# EAGLE design gd32f407v_bb (EAGLE 7.3.0)
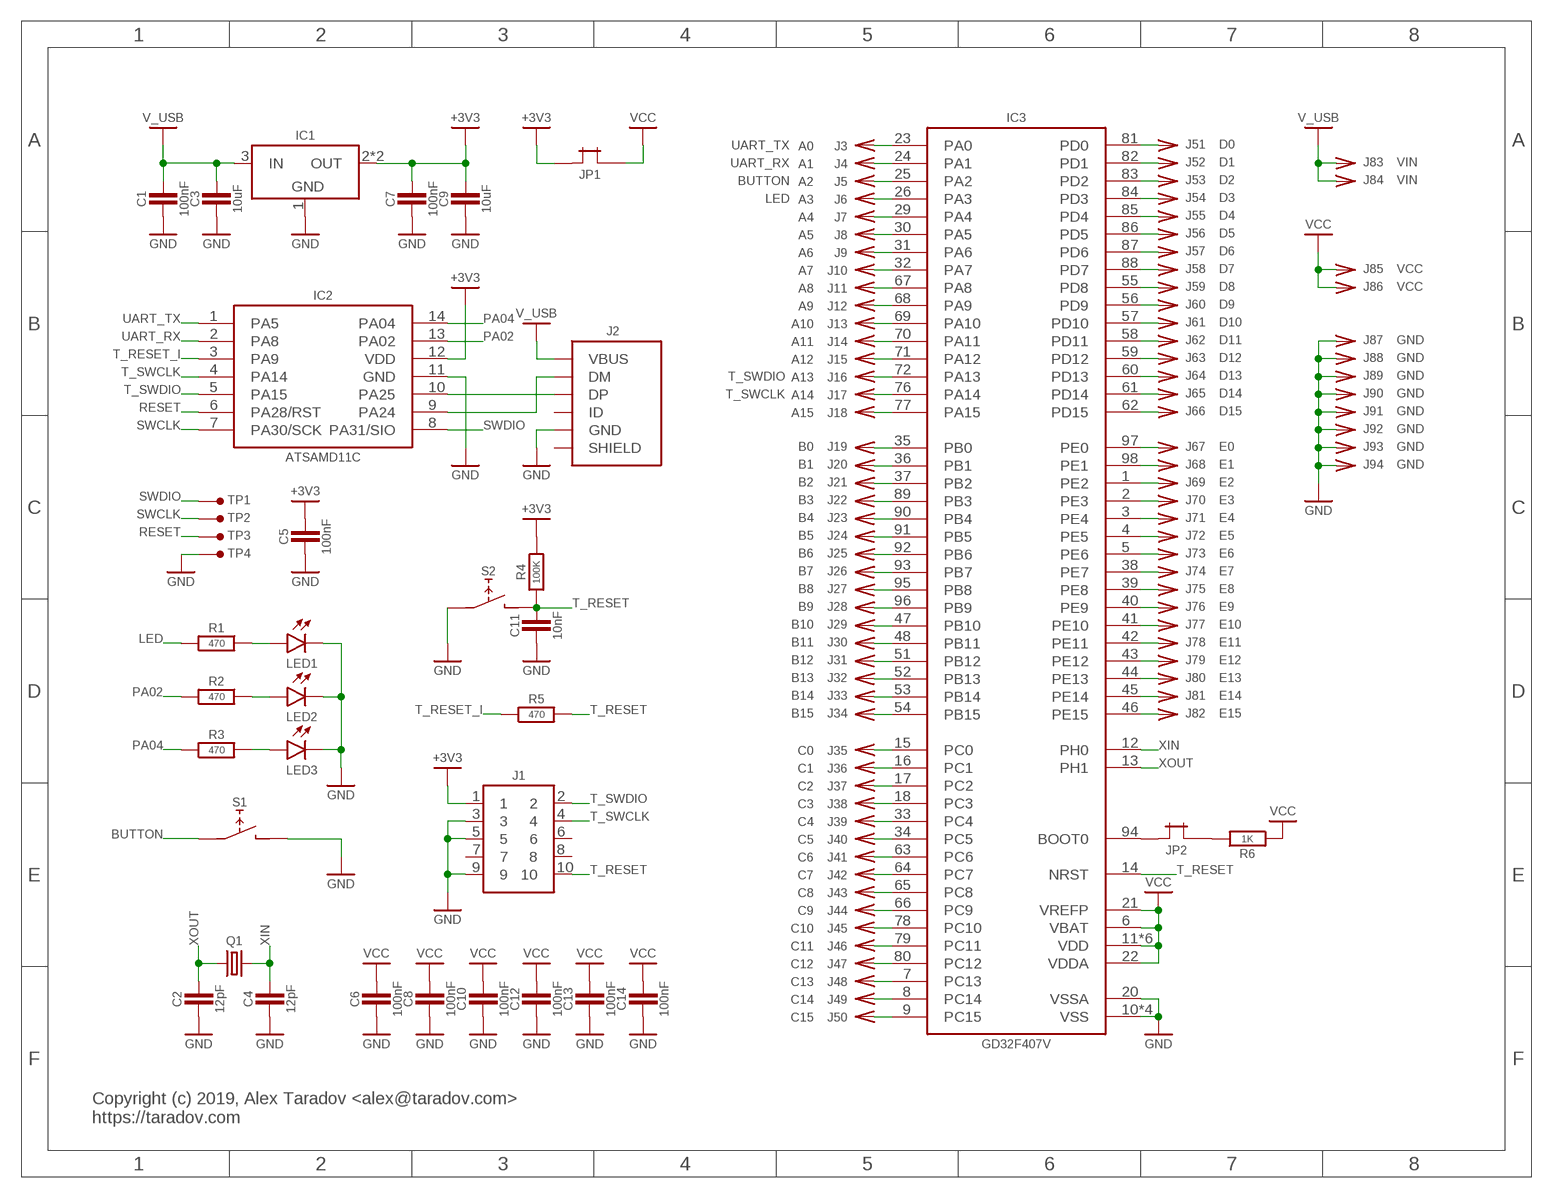
[diagram p0: schematic, sheet 1]

## Parts
C1  100nF  C-0603  [SMD0603]
C2  12pF  C-0603  [SMD0603]
C3  10uF  C-0805  [SMD0805]
C4  12pF  C-0603  [SMD0603]
C5  100nF  C-0603  [SMD0603]
C6  100nF  C-0603  [SMD0603]
C7  100nF  C-0603  [SMD0603]
C8  100nF  C-0603  [SMD0603]
C9  10uF  C-0805  [SMD0805]
C10  100nF  C-0603  [SMD0603]
C11  10nF  C-0603  [SMD0603]
C12  100nF  C-0603  [SMD0603]
C13  100nF  C-0603  [SMD0603]
C14  100nF  C-0603  [SMD0603]
IC1  LM1117-SOT223  [SOT223]
IC2  ATSAMD11C  [SO-14]
IC3  GD32F407V  [TQFP-100-0.5MM]
J1  HEADER-5X2-TH-1.27  [HEADER-5X2-1.27MM]
J2  USB-B-MICRO-SMT  [USB-B-MICRO-SMT-SHELL-TH]
J3  A0  CONN-SINGLE-TH  [PIN-TH]
J4  A1  CONN-SINGLE-TH  [PIN-TH]
J5  A2  CONN-SINGLE-TH  [PIN-TH]
J6  A3  CONN-SINGLE-TH  [PIN-TH]
J7  A4  CONN-SINGLE-TH  [PIN-TH]
J8  A5  CONN-SINGLE-TH  [PIN-TH]
J9  A6  CONN-SINGLE-TH  [PIN-TH]
J10  A7  CONN-SINGLE-TH  [PIN-TH]
J11  A8  CONN-SINGLE-TH  [PIN-TH]
J12  A9  CONN-SINGLE-TH  [PIN-TH]
J13  A10  CONN-SINGLE-TH  [PIN-TH]
J14  A11  CONN-SINGLE-TH  [PIN-TH]
J15  A12  CONN-SINGLE-TH  [PIN-TH]
J16  A13  CONN-SINGLE-TH  [PIN-TH]
J17  A14  CONN-SINGLE-TH  [PIN-TH]
J18  A15  CONN-SINGLE-TH  [PIN-TH]
J19  B0  CONN-SINGLE-TH  [PIN-TH]
J20  B1  CONN-SINGLE-TH  [PIN-TH]
J21  B2  CONN-SINGLE-TH  [PIN-TH]
J22  B3  CONN-SINGLE-TH  [PIN-TH]
J23  B4  CONN-SINGLE-TH  [PIN-TH]
J24  B5  CONN-SINGLE-TH  [PIN-TH]
J25  B6  CONN-SINGLE-TH  [PIN-TH]
J26  B7  CONN-SINGLE-TH  [PIN-TH]
J27  B8  CONN-SINGLE-TH  [PIN-TH]
J28  B9  CONN-SINGLE-TH  [PIN-TH]
J29  B10  CONN-SINGLE-TH  [PIN-TH]
J30  B11  CONN-SINGLE-TH  [PIN-TH]
J31  B12  CONN-SINGLE-TH  [PIN-TH]
J32  B13  CONN-SINGLE-TH  [PIN-TH]
J33  B14  CONN-SINGLE-TH  [PIN-TH]
J34  B15  CONN-SINGLE-TH  [PIN-TH]
J35  C0  CONN-SINGLE-TH  [PIN-TH]
J36  C1  CONN-SINGLE-TH  [PIN-TH]
J37  C2  CONN-SINGLE-TH  [PIN-TH]
J38  C3  CONN-SINGLE-TH  [PIN-TH]
J39  C4  CONN-SINGLE-TH  [PIN-TH]
J40  C5  CONN-SINGLE-TH  [PIN-TH]
J41  C6  CONN-SINGLE-TH  [PIN-TH]
J42  C7  CONN-SINGLE-TH  [PIN-TH]
J43  C8  CONN-SINGLE-TH  [PIN-TH]
J44  C9  CONN-SINGLE-TH  [PIN-TH]
J45  C10  CONN-SINGLE-TH  [PIN-TH]
J46  C11  CONN-SINGLE-TH  [PIN-TH]
J47  C12  CONN-SINGLE-TH  [PIN-TH]
J48  C13  CONN-SINGLE-TH  [PIN-TH]
J49  C14  CONN-SINGLE-TH  [PIN-TH]
J50  C15  CONN-SINGLE-TH  [PIN-TH]
J51  D0  CONN-SINGLE-TH  [PIN-TH]
J52  D1  CONN-SINGLE-TH  [PIN-TH]
J53  D2  CONN-SINGLE-TH  [PIN-TH]
J54  D3  CONN-SINGLE-TH  [PIN-TH]
J55  D4  CONN-SINGLE-TH  [PIN-TH]
J56  D5  CONN-SINGLE-TH  [PIN-TH]
J57  D6  CONN-SINGLE-TH  [PIN-TH]
J58  D7  CONN-SINGLE-TH  [PIN-TH]
J59  D8  CONN-SINGLE-TH  [PIN-TH]
J60  D9  CONN-SINGLE-TH  [PIN-TH]
J61  D10  CONN-SINGLE-TH  [PIN-TH]
J62  D11  CONN-SINGLE-TH  [PIN-TH]
J63  D12  CONN-SINGLE-TH  [PIN-TH]
J64  D13  CONN-SINGLE-TH  [PIN-TH]
J65  D14  CONN-SINGLE-TH  [PIN-TH]
J66  D15  CONN-SINGLE-TH  [PIN-TH]
J67  E0  CONN-SINGLE-TH  [PIN-TH]
J68  E1  CONN-SINGLE-TH  [PIN-TH]
J69  E2  CONN-SINGLE-TH  [PIN-TH]
J70  E3  CONN-SINGLE-TH  [PIN-TH]
J71  E4  CONN-SINGLE-TH  [PIN-TH]
J72  E5  CONN-SINGLE-TH  [PIN-TH]
J73  E6  CONN-SINGLE-TH  [PIN-TH]
J74  E7  CONN-SINGLE-TH  [PIN-TH]
J75  E8  CONN-SINGLE-TH  [PIN-TH]
J76  E9  CONN-SINGLE-TH  [PIN-TH]
J77  E10  CONN-SINGLE-TH  [PIN-TH]
J78  E11  CONN-SINGLE-TH  [PIN-TH]
J79  E12  CONN-SINGLE-TH  [PIN-TH]
J80  E13  CONN-SINGLE-TH  [PIN-TH]
J81  E14  CONN-SINGLE-TH  [PIN-TH]
J82  E15  CONN-SINGLE-TH  [PIN-TH]
J83  VIN  CONN-SINGLE-TH  [PIN-TH]
J84  VIN  CONN-SINGLE-TH  [PIN-TH]
J85  VCC  CONN-SINGLE-TH  [PIN-TH]
J86  VCC  CONN-SINGLE-TH  [PIN-TH]
J87  GND  CONN-SINGLE-TH  [PIN-TH]
J88  GND  CONN-SINGLE-TH  [PIN-TH]
J89  GND  CONN-SINGLE-TH  [PIN-TH]
J90  GND  CONN-SINGLE-TH  [PIN-TH]
J91  GND  CONN-SINGLE-TH  [PIN-TH]
J92  GND  CONN-SINGLE-TH  [PIN-TH]
J93  GND  CONN-SINGLE-TH  [PIN-TH]
J94  GND  CONN-SINGLE-TH  [PIN-TH]
JP1  JUMPER-TH-TH  [JUMPER-TH]
JP2  JUMPER-TH-TH  [JUMPER-TH]
LED1  LED_SMDLED_0603  [SMD0603]
LED2  LED_SMDLED_0603  [SMD0603]
LED3  LED_SMDLED_0603  [SMD0603]
Q1  XTAL-CTS406  [CTS406]
R1  470  R-0603  [SMD0603]
R2  470  R-0603  [SMD0603]
R3  470  R-0603  [SMD0603]
R4  100K  R-0603  [SMD0603]
R5  470  R-0603  [SMD0603]
R6  1K  R-0603  [SMD0603]
S1  TACT_SWITCH_6MM-SMD-HALF  [TACT-SMD-6MM-HALF]
S2  TACT_SWITCH_6MM-SMD-HALF  [TACT-SMD-6MM-HALF]
TP1  SIO  TEST-POINT-1.27MM  [TP-1.27MM]
TP2  TEST-POINT-1.27MM  [TP-1.27MM]
TP3  TEST-POINT-1.27MM  [TP-1.27MM]
TP4  TEST-POINT-1.27MM  [TP-1.27MM]

## Nets
+3V3: C5.2 C7.2 C9.2 IC1.2(OUT) IC1.4(OUT) IC2.12(VDD) J1.1 JP1.1 R4.2
BUTTON: IC3.25(PA2) J5.1 S1.1
GND: C1.1 C2.1 C3.1 C4.1 C5.1 C6.1 C7.1 C8.1 C9.1 C10.1 C11.1 C12.1 C13.1 C14.1 IC1.1(GND) IC2.11(GND) IC3.10(VSS) IC3.20(VSSA) IC3.27(VSS) IC3.74(VSS) IC3.99(VSS) J1.3 J1.5 J1.9 J2.5(GND) J87.1 J88.1 J89.1 J90.1 J91.1 J92.1 J93.1 J94.1 LED1.2(C) LED2.2(C) LED3.2(C) S1.2 S2.1 TP4.1
LED: IC3.26(PA3) J6.1 R1.1
N$1: IC2.9(PA24) J2.2(DM)
N$2: IC2.10(PA25) J2.3(DP)
N$4: LED2.1(A) R2.2
N$6: LED3.1(A) R3.2
N$10: IC3.29(PA4) J7.1
N$12: IC3.30(PA5) J8.1
N$13: IC3.31(PA6) J9.1
N$14: IC3.32(PA7) J10.1
N$15: IC3.67(PA8) J11.1
N$16: IC3.68(PA9) J12.1
N$17: IC3.69(PA10) J13.1
N$18: IC3.70(PA11) J14.1
N$19: IC3.71(PA12) J15.1
N$22: IC3.77(PA15) J18.1
N$23: IC3.81(PD0) J51.1
N$24: IC3.82(PD1) J52.1
N$25: IC3.83(PD2) J53.1
N$26: IC3.84(PD3) J54.1
N$27: IC3.85(PD4) J55.1
N$28: IC3.86(PD5) J56.1
N$29: IC3.87(PD6) J57.1
N$30: IC3.88(PD7) J58.1
N$31: IC3.55(PD8) J59.1
N$32: IC3.56(PD9) J60.1
N$33: IC3.57(PD10) J61.1
N$34: IC3.58(PD11) J62.1
N$35: IC3.59(PD12) J63.1
N$36: IC3.60(PD13) J64.1
N$37: IC3.61(PD14) J65.1
N$38: IC3.62(PD15) J66.1
N$39: IC3.35(PB0) J19.1
N$40: IC3.36(PB1) J20.1
N$41: IC3.37(PB2) J21.1
N$42: IC3.89(PB3) J22.1
N$43: IC3.90(PB4) J23.1
N$44: IC3.91(PB5) J24.1
N$45: IC3.92(PB6) J25.1
N$46: IC3.93(PB7) J26.1
N$47: IC3.95(PB8) J27.1
N$48: IC3.96(PB9) J28.1
N$49: IC3.47(PB10) J29.1
N$50: IC3.48(PB11) J30.1
N$52: IC3.51(PB12) J31.1
N$54: LED1.1(A) R1.2
N$55: IC3.52(PB13) J32.1
N$56: IC3.53(PB14) J33.1
N$57: IC3.54(PB15) J34.1
N$58: IC3.97(PE0) J67.1
N$59: IC3.98(PE1) J68.1
N$60: IC3.1(PE2) J69.1
N$61: IC3.2(PE3) J70.1
N$62: IC3.3(PE4) J71.1
N$63: IC3.4(PE5) J72.1
N$64: IC3.5(PE6) J73.1
N$65: IC3.38(PE7) J74.1
N$66: IC3.39(PE8) J75.1
N$67: IC3.40(PE9) J76.1
N$68: IC3.41(PE10) J77.1
N$69: IC3.42(PE11) J78.1
N$70: IC3.43(PE12) J79.1
N$71: IC3.44(PE13) J80.1
N$72: IC3.45(PE14) J81.1
N$73: IC3.46(PE15) J82.1
N$74: IC3.15(PC0) J35.1
N$75: IC3.16(PC1) J36.1
N$76: IC3.17(PC2) J37.1
N$77: IC3.18(PC3) J38.1
N$78: IC3.33(PC4) J39.1
N$79: IC3.34(PC5) J40.1
N$80: IC3.63(PC6) J41.1
N$81: IC3.64(PC7) J42.1
N$82: IC3.65(PC8) J43.1
N$83: IC3.66(PC9) J44.1
N$84: IC3.78(PC10) J45.1
N$85: IC3.79(PC11) J46.1
N$86: IC3.80(PC12) J47.1
N$87: IC3.7(PC13) J48.1
N$88: IC3.8(PC14) J49.1
N$89: IC3.9(PC15) J50.1
N$90: IC3.94(BOOT0) JP2.1
N$91: JP2.2 R6.2
PA02: IC2.13(PA02) R2.1
PA04: IC2.14(PA04) R3.1
RESET: IC2.6(PA28/RST) TP3.1
SWCLK: IC2.7(PA30/SCK) TP2.1
SWDIO: IC2.8(PA31/SIO) TP1.1
T_RESET: C11.2 IC3.14(NRST) J1.10 R4.1 R5.2 S2.2
T_RESET_I: IC2.3(PA9) R5.1
T_SWCLK: IC2.4(PA14) IC3.76(PA14) J1.4 J17.1
T_SWDIO: IC2.5(PA15) IC3.72(PA13) J1.2 J16.1
UART_RX: IC2.2(PA8) IC3.24(PA1) J4.1
UART_TX: IC2.1(PA5) IC3.23(PA0) J3.1
V_USB: C1.2 C3.2 IC1.3(IN) J2.1(VBUS) J83.1 J84.1
VCC: C6.2 C8.2 C10.2 C12.2 C13.2 C14.2 IC3.6(VBAT) IC3.11(VDD) IC3.19(VDD) IC3.21(VREFP) IC3.22(VDDA) IC3.28(VDD) IC3.50(VDD) IC3.75(VDD) IC3.100(VDD) J85.1 J86.1 JP1.2 R6.1
XIN: C4.2 IC3.12(PH0) Q1.3
XOUT: C2.2 IC3.13(PH1) Q1.1
Unconnected: J1.6 J1.7 J1.8 J2.4(ID) J2.M1(SHIELD) J2.M2(SHIELD) J2.M3(SHIELD) J2.M4(SHIELD)

## Notes on the sheet
- Copyright (c) 2019, Alex Taradov <alex@taradov.com>
  https://taradov.com

## Library data of the parts
C1-C14 = ataradov_rlc:C
IC1 = ataradov_vreg:LM1117: LM1117 voltage regulator
IC2 = ataradov_mcu:ATSAMD11C
IC3 = ataradov_mcu:GD32F407V
J1 = ataradov_conn:HEADER-5X2
J2 = ataradov_conn:USB-B-MICRO
J3-J94 = ataradov_conn:CONN-SINGLE
JP1 JP2 = ataradov_conn:JUMPER-TH
LED1-LED3 = ataradov_led:LED_SMD: SMD_LED
Q1 = ataradov_crystal:XTAL: Generic crystal
R1-R6 = ataradov_rlc:R
S1 S2 = ataradov_switch:TACT_SWITCH_6MM
TP1-TP4 = ataradov_misc:TEST-POINT: Test Point

## Board
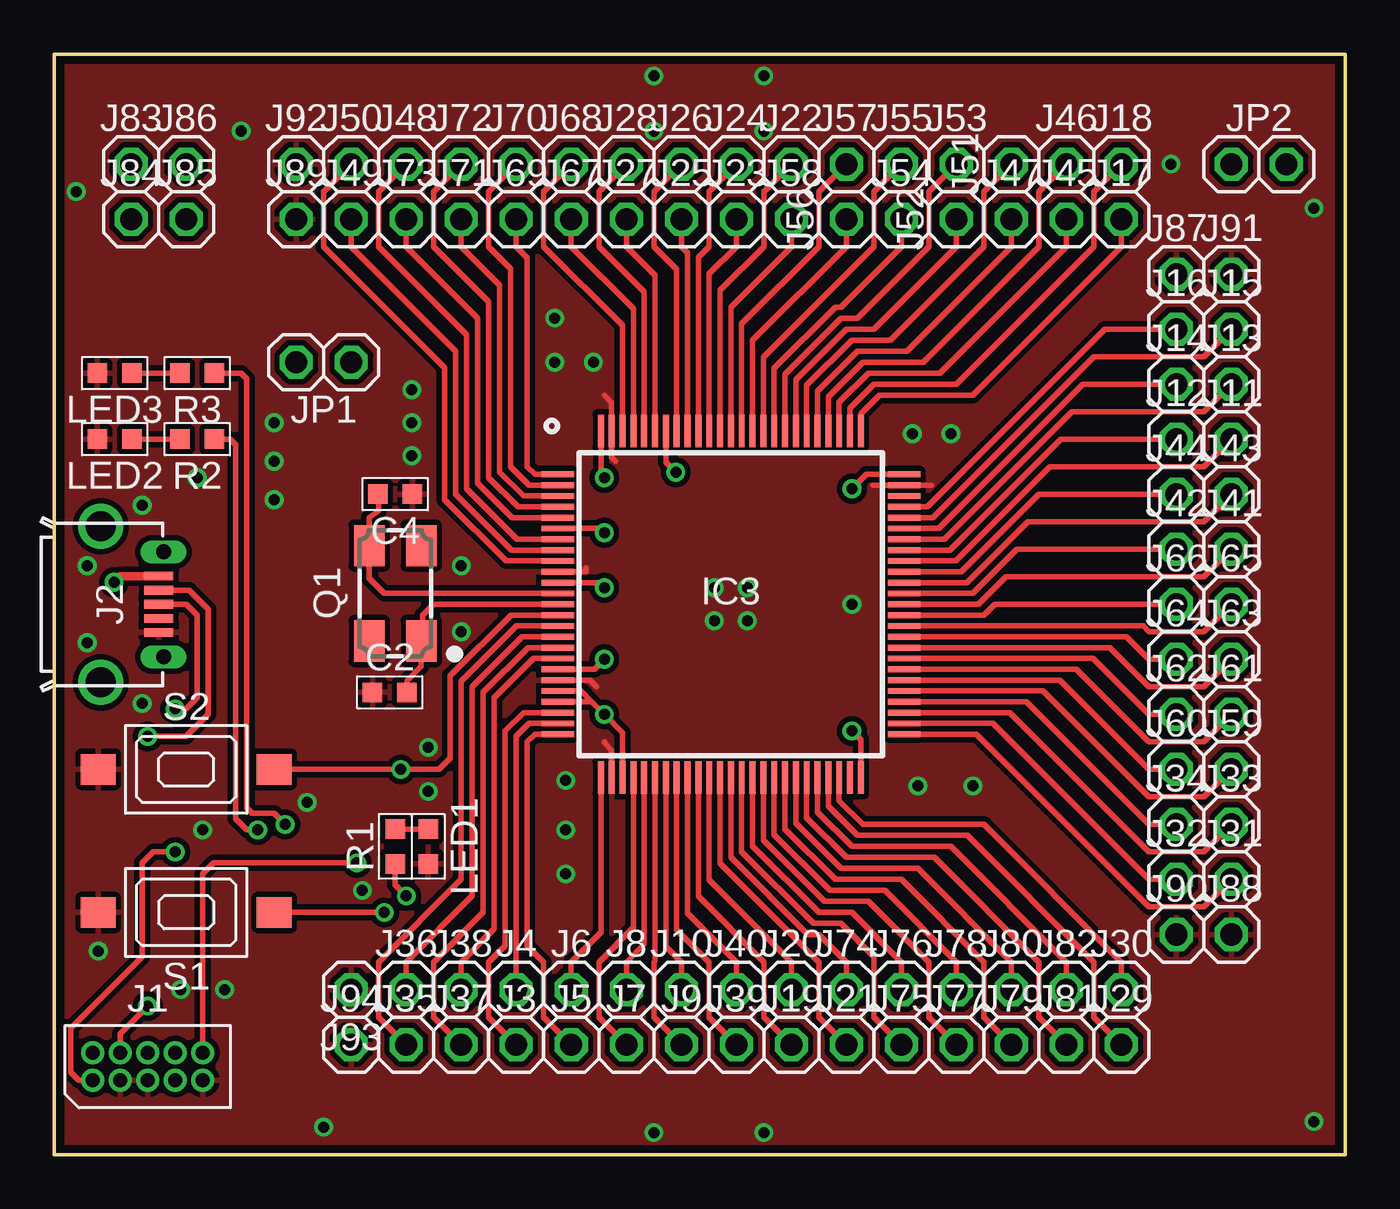
[diagram p1: board, top side]
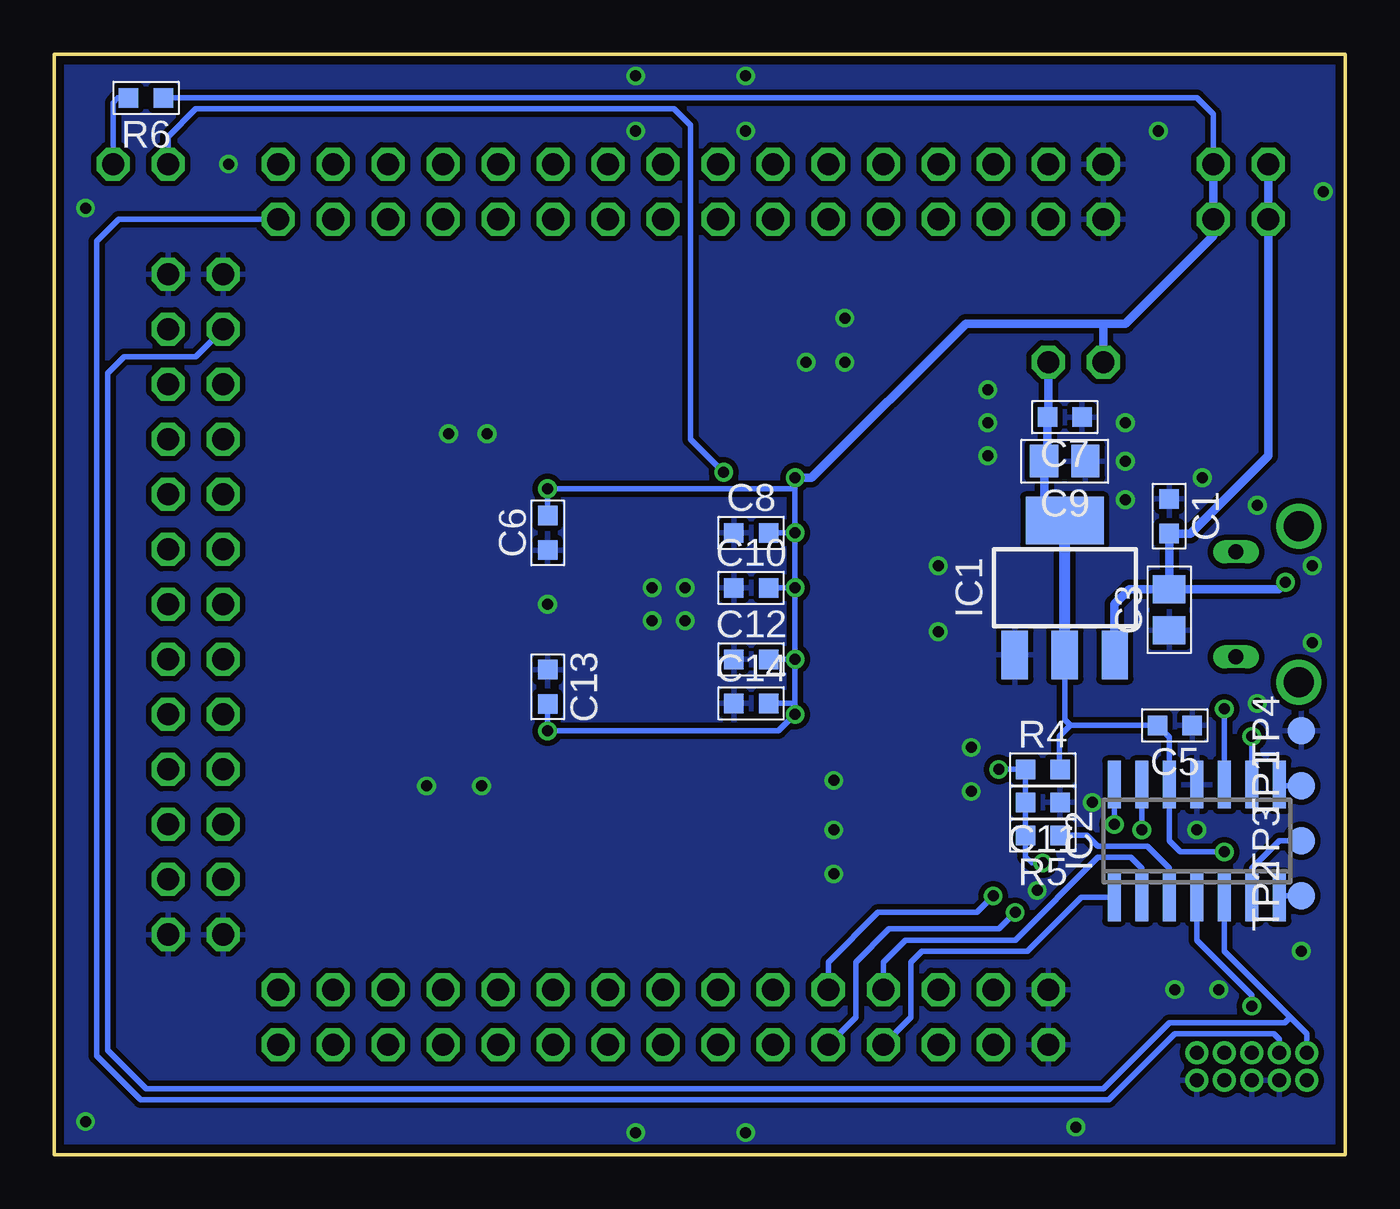
[diagram p2: board, bottom side, seen from below]

Size 59.61 x 50.79 mm. Coordinates in mm from the lower left corner, seen from the top.
Outline: 0,0 59.61,0 59.61,50.79 0,50.79 0,0
Copper layers (1*16): Top 0.0356mm / dielectric 1.5011mm / Bottom 0.0356mm
Design rules "std-tented": minimum track width 6mil, minimum drill 13mil, track to track 6mil, track to pad 6mil, pad to pad 6mil, via to via 6mil, smd to smd 6mil, copper to edge 15mil, drill to drill 6mil, minimum pad ring 7mil, minimum via ring 7mil, stop-mask expansion 3mil, vias tented up to drill 25mil, thermal gap 10mil

### Footprints (pad centres in the part's own frame; a part is rotated, then mirrored left to right if it is on the bottom)
SMD0603 = smd 0.9 x 0.9: 1 -0.8,0; 2 0.8,0
SMD0805 = smd 1.3 x 1.5: 1 -0.95,0; 2 0.95,0
SOT223 = smd 1.219 x 2.235: 1 -2.311,-3.099; 2 0,-3.099; 3 2.311,-3.099 | smd 3.6 x 2.2: 4 0,3.099
SO-14 = smd 0.6 x 2.2: 1 -3.81,-2.6; 2 -2.54,-2.6; 3 -1.27,-2.6; 4 0,-2.6; 5 1.27,-2.6; 6 2.54,-2.6; 7 3.81,-2.6; 8 3.81,2.6; 9 2.54,2.6; 10 1.27,2.6; 11 0,2.6; 12 -1.27,2.6; 13 -2.54,2.6; 14 -3.81,2.6
TQFP-100-0.5MM = smd 1.5 x 0.27: 1 -8,6; 2 -8,5.5; 3 -8,5; 4 -8,4.5; 5 -8,4; 6 -8,3.5; 7 -8,3; 8 -8,2.5; 9 -8,2; 10 -8,1.5; 11 -8,1; 12 -8,0.5; 13 -8,0; 14 -8,-0.5; 15 -8,-1; 16 -8,-1.5; 17 -8,-2; 18 -8,-2.5; 19 -8,-3; 20 -8,-3.5; 21 -8,-4; 22 -8,-4.5; 23 -8,-5; 24 -8,-5.5; 25 -8,-6; 51 8,-6; 52 8,-5.5; 53 8,-5; 54 8,-4.5; 55 8,-4; 56 8,-3.5; 57 8,-3; 58 8,-2.5; 59 8,-2; 60 8,-1.5; 61 8,-1; 62 8,-0.5; 63 8,0; 64 8,0.5; 65 8,1; 66 8,1.5; 67 8,2; 68 8,2.5; 69 8,3; 70 8,3.5; 71 8,4; 72 8,4.5; 73 8,5; 74 8,5.5; 75 8,6 | smd 0.27 x 1.5: 26 -6,-8; 27 -5.5,-8; 28 -5,-8; 29 -4.5,-8; 30 -4,-8; 31 -3.5,-8; 32 -3,-8; 33 -2.5,-8; 34 -2,-8; 35 -1.5,-8; 36 -1,-8; 37 -0.5,-8; 38 0,-8; 39 0.5,-8; 40 1,-8; 41 1.5,-8; 42 2,-8; 43 2.5,-8; 44 3,-8; 45 3.5,-8; 46 4,-8; 47 4.5,-8; 48 5,-8; 49 5.5,-8; 50 6,-8; 76 6,8; 77 5.5,8; 78 5,8; 79 4.5,8; 80 4,8; 81 3.5,8; 82 3,8; 83 2.5,8; 84 2,8; 85 1.5,8; 86 1,8; 87 0.5,8; 88 0,8; 89 -0.5,8; 90 -1,8; 91 -1.5,8; 92 -2,8; 93 -2.5,8; 94 -3,8; 95 -3.5,8; 96 -4,8; 97 -4.5,8; 98 -5,8; 99 -5.5,8; 100 -6,8
HEADER-5X2-1.27MM = drill 0.66 pad 1.067: 1 -2.54,-0.635; 2 -2.54,0.635; 3 -1.27,-0.635; 4 -1.27,0.635; 5 0,-0.635; 6 0,0.635; 7 1.27,-0.635; 8 1.27,0.635; 9 2.54,-0.635; 10 2.54,0.635
USB-B-MICRO-SMT-SHELL-TH = smd 1.35 x 0.4: 1 4.825,1.3; 2 4.825,0.65; 3 4.825,0; 4 4.825,-0.65; 5 4.825,-1.3 | drill 1.397: M1 2.15,-3.6; M2 2.15,3.6 | drill 0.7 long: M3 5.05,2.425; M4 5.05,-2.425
PIN-TH = drill 1.016 octagon: 1 0,0
JUMPER-TH = drill 1.016 octagon: 1 -1.27,0; 2 1.27,0
CTS406 = smd 1.9 x 1.4: 1 -2.2,-1.2; 2 2.2,-1.2; 3 2.2,1.2; 4 -2.2,1.2
TACT-SMD-6MM-HALF = smd 1.6 x 1.4: 1 -4.064,0; 2 4.064,0
TP-1.27MM = smd 1.27 x 1.27: 1 0,0

### Placement (x,y rotation side)
C1  8.13,29.46 270 bottom
C2  15.49,21.34 0 top
C3  8.13,25.15 90 bottom
C4  15.75,30.48 180 top
C5  7.87,19.81 180 bottom
C6  36.83,28.7 90 bottom
C7  12.95,34.04 180 bottom
C8  27.43,28.7 0 bottom
C9  12.95,32 180 bottom
C10  27.43,26.16 0 bottom
C11  13.97,16.26 180 bottom
C12  27.43,22.86 0 bottom
C13  36.83,21.59 270 bottom
C14  27.43,20.83 0 bottom
IC1  12.95,26.16 0 bottom
IC2  6.86,14.48 0 bottom
IC3  31.24,25.4 0 top
J1  4.32,4.06 0 top
J2  0,25.4 0 top
J3  21.34,5.08 0 top
J4  21.34,7.62 0 top
J5  23.88,5.08 0 top
J6  23.88,7.62 0 top
J7  26.42,5.08 0 top
J8  26.42,7.62 0 top
J9  28.96,5.08 0 top
J10  28.96,7.62 0 top
J11  54.36,33.02 0 top
J12  51.82,33.02 0 top
J13  54.36,35.56 0 top
J14  51.82,35.56 0 top
J15  54.36,38.1 0 top
J16  51.82,38.1 0 top
J17  49.28,43.18 0 top
J18  49.28,45.72 0 top
J19  34.04,5.08 0 top
J20  34.04,7.62 0 top
J21  36.58,5.08 0 top
J22  34.04,45.72 0 top
J23  31.5,43.18 0 top
J24  31.5,45.72 0 top
J25  28.96,43.18 0 top
J26  28.96,45.72 0 top
J27  26.42,43.18 0 top
J28  26.42,45.72 0 top
J29  49.28,5.08 0 top
J30  49.28,7.62 0 top
J31  54.36,12.7 0 top
J32  51.82,12.7 0 top
J33  54.36,15.24 0 top
J34  51.82,15.24 0 top
J35  16.26,5.08 0 top
J36  16.26,7.62 0 top
J37  18.8,5.08 0 top
J38  18.8,7.62 0 top
J39  31.5,5.08 0 top
J40  31.5,7.62 0 top
J41  54.36,27.94 0 top
J42  51.82,27.94 0 top
J43  54.36,30.48 0 top
J44  51.82,30.48 0 top
J45  46.74,43.18 0 top
J46  46.74,45.72 0 top
J47  44.2,43.18 0 top
J48  16.26,45.72 0 top
J49  13.72,43.18 0 top
J50  13.72,45.72 0 top
J51  44.2,45.72 90 top
J52  41.66,43.18 90 top
J53  41.66,45.72 0 top
J54  39.12,43.18 0 top
J55  39.12,45.72 0 top
J56  36.58,43.18 90 top
J57  36.58,45.72 0 top
J58  34.04,43.18 0 top
J59  54.36,17.78 0 top
J60  51.82,17.78 0 top
J61  54.36,20.32 0 top
J62  51.82,20.32 0 top
J63  54.36,22.86 0 top
J64  51.82,22.86 0 top
J65  54.36,25.4 0 top
J66  51.82,25.4 0 top
J67  23.88,43.18 0 top
J68  23.88,45.72 0 top
J69  21.34,43.18 0 top
J70  21.34,45.72 0 top
J71  18.8,43.18 0 top
J72  18.8,45.72 0 top
J73  16.26,43.18 0 top
J74  36.58,7.62 0 top
J75  39.12,5.08 0 top
J76  39.12,7.62 0 top
J77  41.66,5.08 0 top
J78  41.66,7.62 0 top
J79  44.2,5.08 0 top
J80  44.2,7.62 0 top
J81  46.74,5.08 0 top
J82  46.74,7.62 0 top
J83  3.56,45.72 0 top
J84  3.56,43.18 0 top
J85  6.1,43.18 0 top
J86  6.1,45.72 0 top
J87  51.82,40.64 0 top
J88  54.36,10.16 0 top
J89  11.18,43.18 0 top
J90  51.82,10.16 0 top
J91  54.36,40.64 0 top
J92  11.18,45.72 0 top
J93  13.72,7.62 180 top
J94  13.72,5.08 0 top
JP1  12.45,36.58 180 top
JP2  55.63,45.72 0 top
LED1  17.27,14.22 270 top
LED2  2.79,33.02 180 top
LED3  2.79,36.07 180 top
Q1  15.75,25.91 90 top
R1  15.75,14.22 90 top
R2  6.6,33.02 180 top
R3  6.6,36.07 180 top
R4  13.97,17.78 0 bottom
R5  13.97,14.73 180 bottom
R6  55.37,48.77 180 bottom
S1  6.1,11.18 180 top
S2  6.1,17.78 0 top
TP1  2.03,17.02 90 bottom
TP2  2.03,11.94 90 bottom
TP3  2.03,14.48 90 bottom
TP4  2.03,19.56 90 bottom

### Tracks (layer width: path | path; a pad name or v marks a point on that pad's centre or on a via)
+3V3  (via drill 0.51 pad 0.86)
  Top 0.254: v5.59,13.97 4.57,13.97 4.06,13.46 4.06,9.14 0.76,5.84 0.76,3.81 1.14,3.43 J1.1
  Bottom 0.254: IC1.4 13.9,30.21 | C9.2 13.75,32.15 | C7.2 13.72,34.07 | 12.7,19.81 C5.2 8.13,19.27 IC2.12 8.13,14.48 7.62,13.97 v5.59,13.97 | 12.7,19.81 12.95,20.07 IC1.2 | R4.2 13.21,17.82 13.21,19.3 12.7,19.81
  Bottom 0.381: 13.9,30.21 C9.2 | 13.75,32.15 C7.2 | 13.72,34.07 JP1.1
  Bottom 0.508: IC1.2 IC1.4
BUTTON  (via drill 0.51 pad 0.3)
  Top 0.254: J5.1 22.61,6.35 22.61,8.89 21.84,9.65 21.84,19.05 22.19,19.4 IC3.25 | S1.1 v15.24,11.18
  Bottom 0.254: v15.24,11.18 16,10.41 21.08,10.41 22.61,8.89 22.61,6.35 J5.1
GND  (via drill 0.51 pad 0.25)
  Top 0.254: IC3.27 25.74,18.67 25.4,19.01 25.4,19.05 | IC3.20 24.73,21.9 25.04,21.59 | IC3.10 24.56,26.9 24.56,27.1 | 37.81,30.9 IC3.74 40.51,30.9 | 25.91,32 25.74,32.17 IC3.99 25.74,34.71 25.4,35.05
  other vias: 1.52,27.18 1.52,23.62 4.06,20.83 23.62,12.95 23.62,17.27 12.45,1.27 58.17,43.69 41.4,33.27 39.88,17.02 32,26.16 24.89,36.58 30.48,24.64 23.62,14.99 51.56,45.72 42.42,17.02 58.17,1.52 30.48,26.16 32,24.64 39.62,33.27 18.8,24.13 18.8,27.18 2.03,9.4 4.06,29.97 8.64,47.24 1.02,44.45 23.11,38.61 23.11,36.58 16.51,32.26 16.51,33.78 16.51,35.31 10.16,33.78 10.16,32 10.16,30.23 6.6,31.24 27.69,47.24 32.77,47.24 27.69,49.78 32.77,49.78 32.77,1.02 27.69,1.02 36.83,25.4 17.27,18.8 17.27,16.76 11.68,16.26 6.86,14.99 14.22,12.19 5.84,7.62 7.87,7.62
  pour Bottom (isolate 0.254): 0,50.8 59.69,50.8 59.69,0 0,0
  pour Top (isolate 0.254): 59.69,50.8 0,50.8 0,0 59.69,0
LED  (via drill 0.51 pad 0.3)
  Top 0.254: IC3.26 25.24,10.26 23.88,8.89 J6.1 | R1.1 15.75,12.45 v16.26,11.94
  Bottom 0.254: v16.26,11.94 17.02,11.18 21.59,11.18 23.88,8.89 J6.1
N$1  (via drill 0.51 pad 0.25)
  Top 0.254: J2.2 6.24,26.05 7.11,25.18 7.11,20.32 6.1,19.3 v4.32,19.3
  Bottom 0.254: v4.32,19.3 IC2.9
N$2  (via drill 0.51 pad 0.25)
  Top 0.254: J2.3 6.1,25.4 6.6,24.89 6.6,21.08 6.1,20.57 v5.59,20.57
  Bottom 0.254: v5.59,20.57 IC2.10
N$4
  Top 0.254: R2.2 LED2.1
N$6
  Top 0.254: LED3.1 R3.2
N$10
  Top 0.254: J7.1 25.15,6.35 25.15,8.89 26.74,10.49 IC3.29
N$12
  Top 0.254: IC3.30 27.24,9.72 26.42,8.89 J8.1
N$13
  Top 0.254: J9.1 27.69,6.35 27.69,8.89 27.74,8.95 IC3.31
N$14
  Top 0.254: J10.1 28.96,8.89 28.24,9.6 IC3.32
N$15
  Top 0.254: J11.1 53.09,31.75 45.97,31.75 41.62,27.4 IC3.67
N$16
  Top 0.254: J12.1 46.48,33.02 41.36,27.9 IC3.68
N$17
  Top 0.254: J13.1 53.09,34.29 46.99,34.29 41.1,28.4 IC3.69
N$18
  Top 0.254: J14.1 47.5,35.56 40.84,28.9 IC3.70
N$19
  Top 0.254: J15.1 53.09,36.83 48.01,36.83 40.58,29.4 IC3.71
N$22
  Top 0.254: J18.1 48.01,44.45 48.01,41.91 41.66,35.56 37.85,35.56 36.74,34.46 IC3.77
N$23
  Top 0.254: J51.1 42.93,44.45 42.93,41.91 38.61,37.59 36.83,37.59 34.74,35.5 IC3.81
N$24
  Top 0.254: IC3.82 34.24,35.77 36.58,38.1 37.85,38.1 41.66,41.91 J52.1
N$25
  Top 0.254: J53.1 40.39,44.45 40.39,41.91 37.08,38.61 36.32,38.61 33.74,36.03 IC3.83
N$26
  Top 0.254: IC3.84 33.24,36.29 36.07,39.12 36.32,39.12 39.12,41.91 J54.1
N$27
  Top 0.254: J55.1 37.85,44.45 37.85,41.91 32.74,36.81 IC3.85
N$28
  Top 0.254: IC3.86 32.24,37.58 36.58,41.91 J56.1
N$29
  Top 0.254: J57.1 35.31,44.45 35.31,41.91 31.74,38.35 IC3.87
N$30
  Top 0.254: IC3.88 31.24,39.12 34.04,41.91 J58.1
N$31
  Top 0.254: J59.1 53.09,16.51 50.55,16.51 45.66,21.4 IC3.55
N$32
  Top 0.254: J60.1 50.55,17.78 46.43,21.9 IC3.56
N$33
  Top 0.254: J61.1 53.09,19.05 50.55,19.05 47.2,22.4 IC3.57
N$34
  Top 0.254: J62.1 50.55,20.32 47.97,22.9 IC3.58
N$35
  Top 0.254: J63.1 53.09,21.59 50.55,21.59 48.74,23.4 IC3.59
N$36
  Top 0.254: IC3.60 49.51,23.9 50.55,22.86 J64.1
N$37
  Top 0.254: J65.1 53.09,24.13 50.55,24.13 50.28,24.4 IC3.61
N$38
  Top 0.254: IC3.62 42.93,24.9 43.43,25.4 J66.1
N$39
  Top 0.254: J19.1 32.77,6.35 32.77,8.89 29.74,11.91 IC3.35
N$40
  Top 0.254: J20.1 34.04,8.89 30.24,12.68 IC3.36
N$41
  Top 0.254: J21.1 35.31,6.35 35.31,8.89 30.74,13.45 IC3.37
N$42
  Top 0.254: J22.1 32.77,44.45 32.77,41.91 30.74,39.89 IC3.89
N$43
  Top 0.254: IC3.90 30.24,40.66 31.5,41.91 J23.1
N$44
  Top 0.254: J24.1 30.23,44.45 30.23,41.91 29.74,41.43 IC3.91
N$45
  Top 0.254: J25.1 28.96,41.91 29.24,41.62 IC3.92
N$46
  Top 0.254: J26.1 27.69,44.45 27.69,41.91 28.74,40.85 IC3.93
N$47
  Top 0.254: J27.1 26.42,41.91 27.74,40.58 IC3.95
N$48
  Top 0.254: J28.1 25.15,44.45 25.15,41.91 27.24,39.81 IC3.96
N$49
  Top 0.254: J29.1 48.01,6.35 48.01,8.89 42.16,14.73 37.08,14.73 35.74,16.07 IC3.47
N$50
  Top 0.254: J30.1 49.28,8.89 42.93,15.24 37.34,15.24 36.24,16.34 IC3.48
N$52
  Top 0.254: J31.1 53.09,11.43 50.55,11.43 42.58,19.4 IC3.51
N$54
  Top 0.254: R1.2 LED1.1
N$55
  Top 0.254: J32.1 50.55,12.7 43.35,19.9 IC3.52
N$56
  Top 0.254: J33.1 53.09,13.97 50.55,13.97 44.12,20.4 IC3.53
N$57
  Top 0.254: J34.1 50.55,15.24 44.89,20.9 IC3.54
N$58
  Top 0.254: J67.1 23.88,41.91 26.74,39.04 IC3.97
N$59
  Top 0.254: J68.1 22.61,44.45 22.61,41.91 26.24,38.27 IC3.98
N$60
  Top 0.254: J69.1 21.34,41.91 21.84,41.4 21.84,31.75 22.19,31.4 IC3.1
N$61
  Top 0.254: J70.1 20.07,44.45 20.07,41.91 21.08,40.89 21.08,31.75 21.93,30.9 IC3.2
N$62
  Top 0.254: IC3.3 21.67,30.4 20.57,31.5 20.57,40.13 18.8,41.91 J71.1
N$63
  Top 0.254: J72.1 17.53,44.45 17.53,41.91 20.07,39.37 20.07,31.24 21.41,29.9 IC3.4
N$64
  Top 0.254: IC3.5 21.15,29.4 19.56,30.99 19.56,38.61 16.26,41.91 J73.1
N$65
  Top 0.254: J74.1 36.58,8.89 35.31,10.16 34.8,10.16 31.24,13.72 IC3.38
N$66
  Top 0.254: J75.1 37.85,6.35 37.85,9.14 36.32,10.67 35.05,10.67 31.74,13.98 IC3.39
N$67
  Top 0.254: J76.1 39.12,8.89 36.83,11.18 35.31,11.18 32.24,14.24 IC3.40
N$68
  Top 0.254: J77.1 40.39,6.35 40.39,8.89 37.59,11.68 35.56,11.68 32.74,14.5 IC3.41
N$69
  Top 0.254: IC3.42 33.24,14.76 35.81,12.19 38.35,12.19 41.66,8.89 J78.1
N$70
  Top 0.254: J79.1 42.93,6.35 42.93,8.89 39.12,12.7 36.07,12.7 33.74,15.03 IC3.43
N$71
  Top 0.254: J80.1 44.2,8.89 39.88,13.21 36.32,13.21 34.24,15.29 IC3.44
N$72
  Top 0.254: J81.1 45.47,6.35 45.47,8.89 40.64,13.72 36.58,13.72 34.74,15.55 IC3.45
N$73
  Top 0.254: J82.1 46.74,8.89 41.4,14.22 36.83,14.22 35.24,15.81 IC3.46
N$74
  Top 0.254: J35.1 14.99,6.35 14.99,8.89 18.8,12.7 18.8,21.84 21.35,24.4 IC3.15
N$75
  Top 0.254: J36.1 16.26,8.89 19.3,11.94 19.3,21.59 21.61,23.9 IC3.16
N$76
  Top 0.254: J37.1 17.53,6.35 17.53,8.89 19.81,11.18 19.81,21.34 21.88,23.4 IC3.17
N$77
  Top 0.254: IC3.18 22.14,22.9 20.32,21.08 20.32,10.41 18.8,8.89 J38.1
N$78
  Top 0.254: J39.1 30.23,6.35 30.23,8.89 28.74,10.37 IC3.33
N$79
  Top 0.254: J40.1 31.5,8.89 29.24,11.14 IC3.34
N$80
  Top 0.254: J41.1 53.09,26.67 43.94,26.67 42.67,25.4 IC3.63
N$81
  Top 0.254: J42.1 44.45,27.94 42.41,25.9 IC3.64
N$82
  Top 0.254: J43.1 53.09,29.21 44.96,29.21 42.15,26.4 IC3.65
N$83
  Top 0.254: J44.1 45.47,30.48 41.89,26.9 IC3.66
N$84
  Top 0.254: IC3.78 36.24,34.72 37.59,36.07 40.89,36.07 46.74,41.91 J45.1
N$85
  Top 0.254: J46.1 45.47,44.45 45.47,41.91 40.13,36.58 37.34,36.58 35.74,34.98 IC3.79
N$86
  Top 0.254: IC3.80 35.24,35.24 37.08,37.08 39.37,37.08 44.2,41.91 J47.1
N$87
  Top 0.254: J48.1 14.99,44.45 14.99,41.91 19.05,37.85 19.05,30.73 21.38,28.4 IC3.7
N$88
  Top 0.254: IC3.8 21.12,27.9 18.54,30.48 18.54,37.08 13.72,41.91 J49.1
N$89
  Top 0.254: J50.1 12.45,44.45 12.45,41.91 18.03,36.32 18.03,30.23 20.86,27.4 IC3.9
N$90  (via drill 0.51 pad 0.3)
  Top 0.254: v28.7,31.5 28.24,31.96 IC3.94
  Bottom 0.254: v28.7,31.5 30.23,33.02 30.23,47.5 30.99,48.26 53.09,48.26 54.36,46.99 JP2.1
N$91
  Bottom 0.254: JP2.2 56.9,48.55 56.68,48.77 R6.2
PA02  (via drill 0.51 pad 0.3)
  Top 0.254: R2.1 8.13,33.02 8.38,32.77 8.38,15.49 8.89,14.99 v9.4,14.99
  Bottom 0.254: IC2.13 v9.4,14.99
PA04  (via drill 0.51 pad 0.3)
  Top 0.254: R3.1 8.64,36.07 8.89,35.81 8.89,16 9.14,15.75 10.16,15.75 v10.67,15.24
  Bottom 0.254: IC2.14 v10.67,15.24
RESET
  Bottom 0.254: IC2.6 4.32,13.21 3.05,14.48 TP3.1
SWCLK
  Bottom 0.254: IC2.7 2.99,11.94 TP2.1
SWDIO
  Bottom 0.254: IC2.8 2.99,17.02 TP1.1
T_RESET  (via drill 0.51 pad 0.3, 0.51 pad 0.86)
  Top 0.254: IC3.14 21.09,24.9 18.29,22.1 18.29,18.29 17.78,17.78 v16,17.78 S2.2 | v13.97,13.46 7.37,13.46 6.86,12.95 J1.10
  Bottom 0.254: v16,17.78 R4.1 C11.2 R5.2 14.77,13.75 14.48,13.46 v13.97,13.46
T_RESET_I
  Bottom 0.254: IC2.3 8.13,13.21 9.14,14.22 11.43,14.22 11.94,14.73 R5.1
T_SWCLK  (via drill 0.51 pad 0.86)
  Top 0.254: J17.1 49.28,41.91 42.42,35.05 38.1,35.05 37.24,34.19 IC3.76 | v4.32,6.86 3.05,5.59 J1.4
  Bottom 0.254: J17.1 56.64,43.18 57.66,42.16 57.66,4.57 55.63,2.54 10.92,2.54 7.87,5.59 3.3,5.59 3.05,5.33 J1.4 | IC2.4 6.86,9.91 4.32,7.37 v4.32,6.86
T_SWDIO
  Top 0.254: J16.1 48.51,38.1 40.31,29.9 IC3.72
  Bottom 0.254: J16.1 53.09,36.83 56.39,36.83 57.15,36.07 57.15,4.83 55.37,3.05 11.18,3.05 8.13,6.1 2.79,6.1 2.54,6.35 | J1.2 1.78,5.59 2.54,6.35 | IC2.5 5.59,9.4 2.54,6.35
UART_RX
  Top 0.254: J4.1 21.34,19.3 21.93,19.9 IC3.24
  Bottom 0.254: IC2.2 9.4,13.21 9.91,13.72 11.43,13.72 15.24,9.91 20.32,9.91 21.34,8.89 J4.1
UART_TX
  Top 0.254: J3.1 20.07,6.35 20.07,8.89 20.83,9.65 20.83,19.56 21.67,20.4 IC3.23
  Bottom 0.254: J3.1 20.07,6.35 20.07,8.89 19.56,9.4 14.67,9.4 12.19,11.88 IC2.1
V_USB  (via drill 0.51 pad 0.3)
  Top 0.381: v2.76,26.42 3.05,26.7 J2.1
  Bottom 0.254: IC1.3 10.67,23.09
  Bottom 0.381: J83.1 J84.1 3.56,32.26 7.15,28.66 C1.2 C3.2 | C3.2 3.62,26.1 3.08,26.1 v2.76,26.42 | 10.67,23.09 10.67,25.4 9.97,26.1 C3.2
VCC  (via drill 0.51 pad 0.3)
  Top 0.254: v36.83,30.73 37.5,31.4 IC3.75 | v36.83,19.56 37.24,19.15 IC3.50 | IC3.28 26.24,19.48 v25.4,20.32 24.82,20.9 | 24.82,20.9 IC3.22 | IC3.19 24.94,22.4 v25.4,22.86 | IC3.21 24.32,21.4 24.82,20.9 | IC3.11 25.16,26.4 v25.4,26.16 | IC3.6 25.2,28.9 v25.4,28.7 | IC3.100 25.24,31.34 v25.4,31.24
  Bottom 0.254: C6.2 v36.83,30.73 25.4,30.73 | C13.2 v36.83,19.56 26.16,19.56 v25.4,20.32 25.4,20.83 | J86.1 6.1,48.01 6.86,48.77 R6.1 | 25.4,20.83 v25.4,22.86 | v25.4,22.86 v25.4,26.16 | v25.4,26.16 v25.4,28.7 | v25.4,28.7 25.4,30.73 | 25.4,30.73 v25.4,31.24 | C12.2 v25.4,22.86 | C14.2 25.4,20.83 | C10.2 v25.4,26.16 | C8.2 v25.4,28.7
  Bottom 0.381: J86.1 J85.1 6.1,42.42 10.16,38.35 11.18,38.35 | JP1.2 11.18,38.35 | 11.18,38.35 17.53,38.35 24.64,31.24 v25.4,31.24
XIN
  Top 0.254: IC3.12 16.26,25.9 16.26,25.91 15.24,25.91 14.55,26.6 Q1.3 14.55,29.39 14.99,29.72 14.99,30.44 C4.2
XOUT
  Top 0.254: IC3.13 17.53,25.4 17.02,24.89 17.02,23.78 Q1.1 16.95,22.54 16.29,21.88 C2.2

### Text on the board
tValues: BOOT0 | www.taradov.com | RESET | USER | AT | 10/06/19